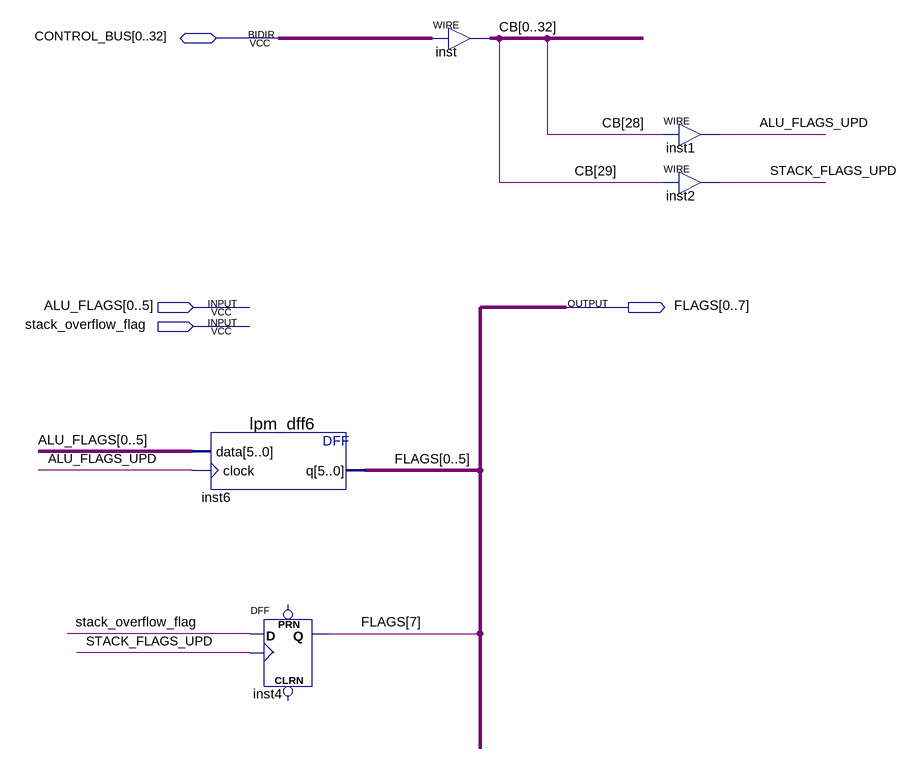
[diagram p0: schematic sheet]
// Quartus schematic FLAGS.bdf as structural Verilog: 5 symbols, 4 pins
module FLAGS (
  input  [0:5] ALU_FLAGS,
  input  stack_overflow_flag,
  inout  [0:32] CONTROL_BUS,
  output [0:7] FLAGS
);

  wire ALU_FLAGS_UPD, STACK_FLAGS_UPD;
  wire [32:0] CB;

  lpm_dff6 inst6 (.data(ALU_FLAGS), .clock(ALU_FLAGS_UPD), .q(FLAGS[0:5]));
  DFF inst4 (.CLK(STACK_FLAGS_UPD), .D(stack_overflow_flag), .Q(FLAGS[7]));  // open: CLRN, PRN
  assign {CB[0], CB[1], CB[2], CB[3], CB[4], CB[5], CB[6], CB[7], CB[8], CB[9], CB[10], CB[11], CB[12], CB[13], CB[14], CB[15], CB[16], CB[17], CB[18], CB[19], CB[20], CB[21], CB[22], CB[23], CB[24], CB[25], CB[26], CB[27], CB[28], CB[29], CB[30], CB[31], CB[32]} = CONTROL_BUS;  // WIRE inst
  assign ALU_FLAGS_UPD = CB[28];  // WIRE inst1
  assign STACK_FLAGS_UPD = CB[29];  // WIRE inst2
endmodule
